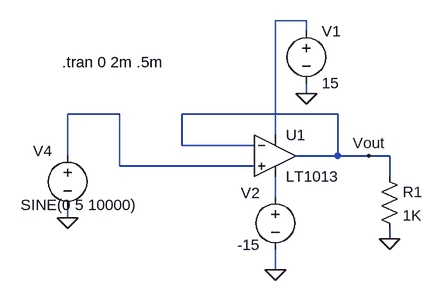
[diagram p0: schematic Opamp Buffer.asc]
Opamp Buffer.asc, the LTspice schematic file:
Version 4
SHEET 1 880 680
WIRE 288 -64 240 -64
WIRE 288 -48 288 -64
WIRE 288 48 288 32
WIRE 0 80 -80 80
WIRE 336 80 96 80
WIRE 240 112 240 -64
WIRE 96 128 96 80
WIRE 208 128 96 128
WIRE -80 144 -80 80
WIRE 336 144 336 80
WIRE 336 144 272 144
WIRE 384 144 336 144
WIRE 416 144 384 144
WIRE 0 160 0 80
WIRE 208 160 0 160
WIRE 416 176 416 144
WIRE 240 208 240 176
WIRE -80 240 -80 224
WIRE 416 272 416 256
WIRE 240 320 240 288
FLAG 288 48 0
FLAG 240 320 0
FLAG 384 144 Vout
FLAG 416 272 0
FLAG -80 240 0
SYMBOL Opamps\\LT1013 240 80 R0
SYMATTR InstName U1
SYMBOL voltage 288 -64 R0
WINDOW 123 0 0 Left 2
WINDOW 39 0 0 Left 2
SYMATTR InstName V1
SYMATTR Value 15
SYMBOL res 400 160 R0
SYMATTR InstName R1
SYMATTR Value 1K
SYMBOL voltage -80 128 R0
WINDOW 0 -53 9 Left 2
WINDOW 3 -72 92 Left 2
WINDOW 123 0 0 Left 2
WINDOW 39 0 0 Left 2
SYMATTR InstName V4
SYMATTR Value SINE(0 5 10000)
SYMBOL voltage 240 192 R0
WINDOW 0 -53 9 Left 2
WINDOW 3 -58 89 Left 2
WINDOW 123 0 0 Left 2
WINDOW 39 0 0 Left 2
SYMATTR InstName V2
SYMATTR Value -15
TEXT -88 0 Left 2 !.tran 0 2m .5m

The netlist it stands for:
* Opamp Buffer.asc
XU1 N002 Vout N001 N003 Vout LT1013  ; pins In+ In- V+ V- OUT
V1 N001 0 15
R1 Vout 0 1K
V4 N002 0 SINE(0 5 10000)
V2 N003 0 -15
.tran 0 2m .5m
.lib LTC.lib
.backanno
.end